# Altium schematic sheet 6_Airframe-NXP_i.MX7.SchDoc
size A2; SheetNumber: 6; SheetTotal: 9
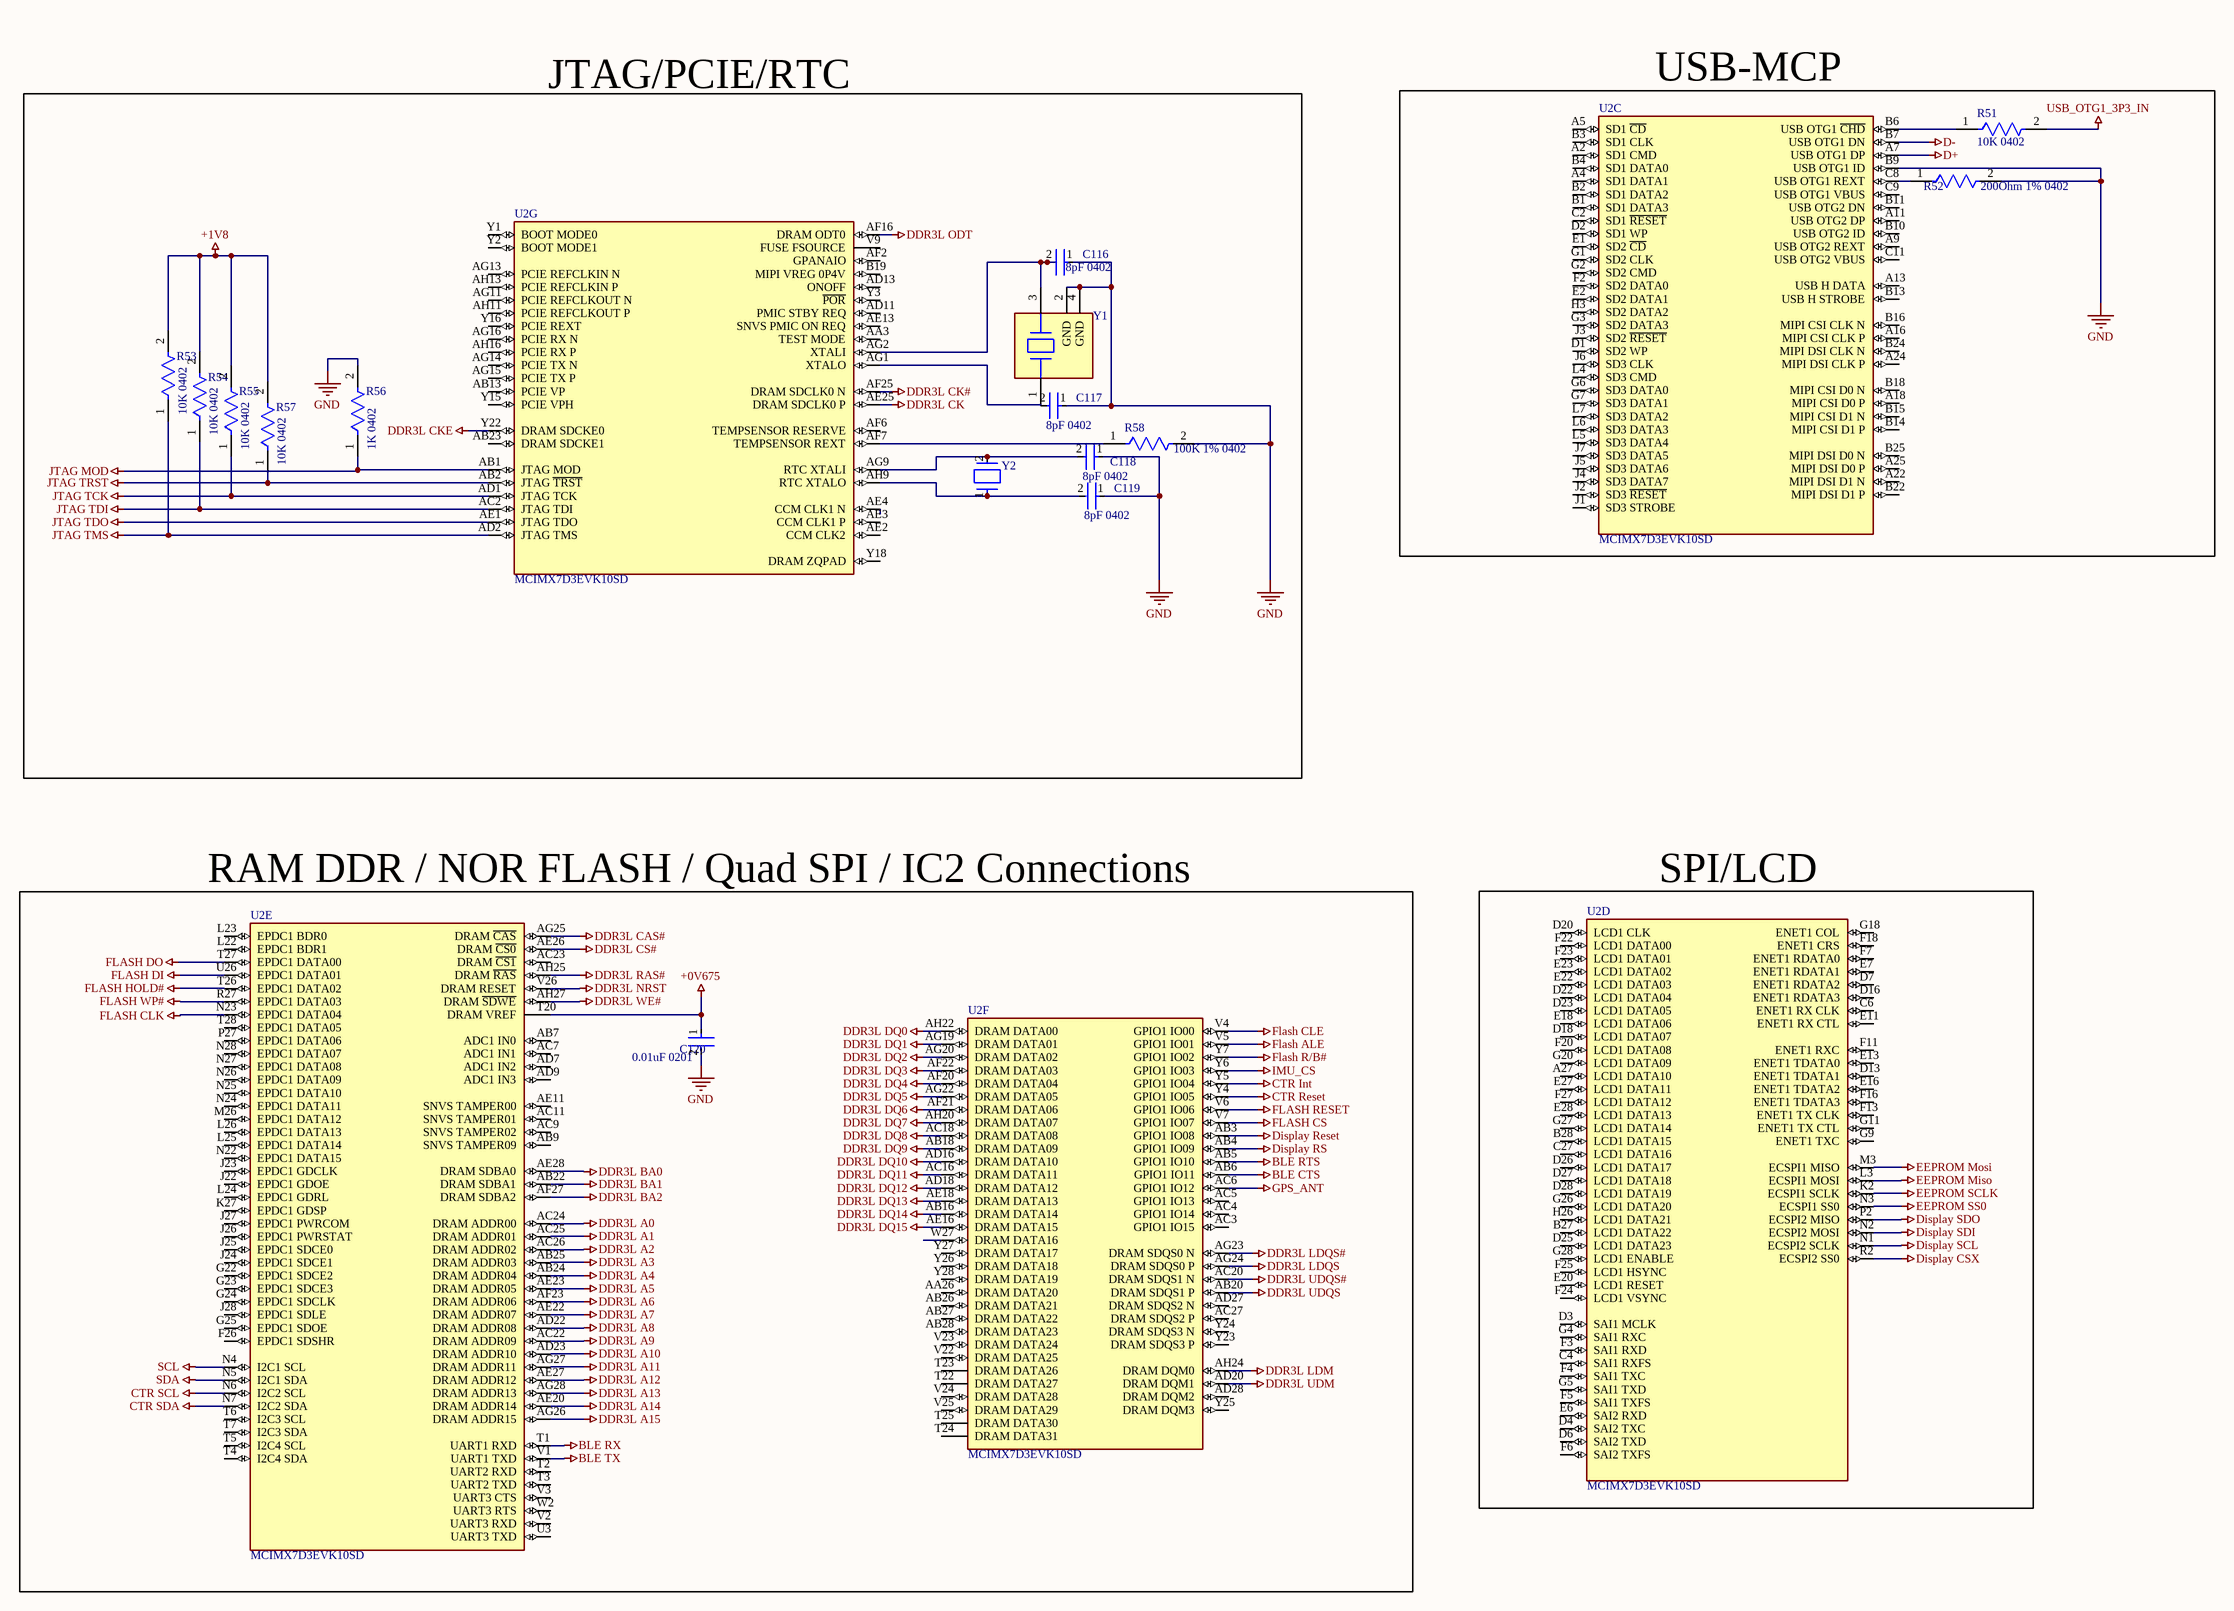
[diagram p0: 6_Airframe-NXP_i.MX7.SchDoc]

## Parts
C116  8pF 0402  [FP-C0402C225M9PACTU-MFG]
C117  8pF 0402  [FP-C0402C225M9PACTU-MFG]
C118  8pF 0402  [FP-C0402C225M9PACTU-MFG]
C119  8pF 0402  [FP-C0402C225M9PACTU-MFG]
C120  0.01uF 0201  [FP-C0603-030-0_03-IPC_C]
R51  10K 0402  [FP-CRCW0402-e3-IPC_B]
R52  200Ohm 1% 0402  [FP-CRCW0402-e3-IPC_C]
R53  10K 0402  [FP-CRCW0402-e3-IPC_B]
R54  10K 0402  [FP-CRCW0402-e3-IPC_B]
R55  10K 0402  [FP-CRCW0402-e3-IPC_B]
R56  1K 0402  [FP-CRCW0402-e3-IPC_B]
R57  10K 0402  [FP-CRCW0402-e3-IPC_B]
R58  100K 1% 0402  [FP-CRCW0402-e3-IPC_C]
U2  MCIMX7D3EVK10SD  [FP-SOT1839-1-IPC_C]  (parts C,D,E,F,G of 9)
Y1  ABM8AIG-24.000MHZ-12-2Z-T3  [FP-ABM8AIG-MFG]  (value not drawn)
Y2  ABS06-32.768KHZ-9-T  [FP-ABS06-MFG]  (value not drawn)

## Nets
+0V675: C120.1 U2.T20(DRAM_VREF)
+1V8: R53.2 R54.2 R55.2 R57.2
BLE CTS: U2.AB6(GPIO1_IO11)
BLE RTS: U2.AB5(GPIO1_IO10)
BLE RX: U2.T1(UART1_RXD)
BLE TX: U2.V1(UART1_TXD)
CTR Int: U2.Y5(GPIO1_IO04)
CTR Reset: U2.Y4(GPIO1_IO05)
CTR SCL: U2.N6(I2C2_SCL)
CTR SDA: U2.N7(I2C2_SDA)
D+: U2.A7(USB_OTG1_DP)
D-: U2.B7(USB_OTG1_DN)
DDR3L A0: U2.AC24(DRAM_ADDR00)
DDR3L A1: U2.AC25(DRAM_ADDR01)
DDR3L A2: U2.AC26(DRAM_ADDR02)
DDR3L A3: U2.AB25(DRAM_ADDR03)
DDR3L A4: U2.AB24(DRAM_ADDR04)
DDR3L A5: U2.AE23(DRAM_ADDR05)
DDR3L A6: U2.AF23(DRAM_ADDR06)
DDR3L A7: U2.AE22(DRAM_ADDR07)
DDR3L A8: U2.AD22(DRAM_ADDR08)
DDR3L A9: U2.AC22(DRAM_ADDR09)
DDR3L A10: U2.AD23(DRAM_ADDR10)
DDR3L A11: U2.AG27(DRAM_ADDR11)
DDR3L A12: U2.AE27(DRAM_ADDR12)
DDR3L A13: U2.AG28(DRAM_ADDR13)
DDR3L A14: U2.AE20(DRAM_ADDR14)
DDR3L A15: U2.AG26(DRAM_ADDR15)
DDR3L BA0: U2.AE28(DRAM_SDBA0)
DDR3L BA1: U2.AB22(DRAM_SDBA1)
DDR3L BA2: U2.AF27(DRAM_SDBA2)
DDR3L CAS#: U2.AG25(DRAM_~{CAS})
DDR3L CK: U2.AE25(DRAM_SDCLK0_P)
DDR3L CK#: U2.AF25(DRAM_SDCLK0_N)
DDR3L CKE: U2.Y22(DRAM_SDCKE0)
DDR3L CS#: U2.AE26(DRAM_~{CS0})
DDR3L DQ0: U2.AH22(DRAM_DATA00)
DDR3L DQ1: U2.AG19(DRAM_DATA01)
DDR3L DQ2: U2.AG20(DRAM_DATA02)
DDR3L DQ3: U2.AF22(DRAM_DATA03)
DDR3L DQ4: U2.AF20(DRAM_DATA04)
DDR3L DQ5: U2.AG22(DRAM_DATA05)
DDR3L DQ6: U2.AF21(DRAM_DATA06)
DDR3L DQ7: U2.AH20(DRAM_DATA07)
DDR3L DQ8: U2.AC18(DRAM_DATA08)
DDR3L DQ9: U2.AB18(DRAM_DATA09)
DDR3L DQ10: U2.AD16(DRAM_DATA10)
DDR3L DQ11: U2.AC16(DRAM_DATA11)
DDR3L DQ12: U2.AD18(DRAM_DATA12)
DDR3L DQ13: U2.AE18(DRAM_DATA13)
DDR3L DQ14: U2.AB16(DRAM_DATA14)
DDR3L DQ15: U2.AE16(DRAM_DATA15)
DDR3L LDM: U2.AH24(DRAM_DQM0)
DDR3L LDQS: U2.AG24(DRAM_SDQS0_P)
DDR3L LDQS#: U2.AG23(DRAM_SDQS0_N)
DDR3L NRST: U2.V26(DRAM_RESET)
DDR3L ODT: U2.AF16(DRAM_ODT0)
DDR3L RAS#: U2.AH25(DRAM_~{RAS})
DDR3L UDM: U2.AD20(DRAM_DQM1)
DDR3L UDQS: U2.AB20(DRAM_SDQS1_P)
DDR3L UDQS#: U2.AC20(DRAM_SDQS1_N)
DDR3L WE#: U2.AH27(DRAM_~{SDWE})
Display CSX: U2.R2(ECSPI2_SS0)
Display Reset: U2.AB3(GPIO1_IO08)
Display RS: U2.AB4(GPIO1_IO09)
Display SCL: U2.N1(ECSPI2_SCLK)
Display SDI: U2.N2(ECSPI2_MOSI)
Display SDO: U2.P2(ECSPI2_MISO)
EEPROM Miso: U2.L3(ECSPI1_MOSI)
EEPROM Mosi: U2.M3(ECSPI1_MISO)
EEPROM SCLK: U2.K2(ECSPI1_SCLK)
EEPROM SS0: U2.N3(ECSPI1_SS0)
Flash ALE: U2.V5(GPIO1_IO01)
Flash CLE: U2.V4(GPIO1_IO00)
FLASH CLK: U2.N23(EPDC1_DATA04)
FLASH CS: U2.V7(GPIO1_IO07)
FLASH DI: U2.U26(EPDC1_DATA01)
FLASH DO: U2.T27(EPDC1_DATA00)
FLASH HOLD#: U2.T26(EPDC1_DATA02)
Flash R/B#: U2.Y7(GPIO1_IO02)
FLASH RESET: U2.V6(GPIO1_IO06)
FLASH WP#: U2.R27(EPDC1_DATA03)
GND: C116.1 C117.1 C118.1 C119.1 C120.2 R52.2 R56.2 R58.2 U2.B9(USB_OTG1_ID) Y1.2(GND) Y1.4(GND)
GPS_ANT: U2.AC6(GPIO1_IO12)
IMU_CS: U2.Y6(GPIO1_IO03)
JTAG MOD: R56.1 U2.AB1(JTAG_MOD)
JTAG TCK: R55.1 U2.AD1(JTAG_TCK)
JTAG TDI: R54.1 U2.AC2(JTAG_TDI)
JTAG TDO: U2.AE1(JTAG_TDO)
JTAG TMS: R53.1 U2.AD2(JTAG_TMS)
JTAG TRST: R57.1 U2.AB2(JTAG_~{TRST})
SCL: U2.N4(I2C1_SCL)
SDA: U2.N5(I2C1_SDA)
USB_OTG1_3P3_IN: R51.2
NetC116_2: C116.2 U2.AG2(XTALI) Y1.3
NetC118_2: C118.2 U2.AG9(RTC_XTALI) Y2.2
NetC119_2: C119.2 U2.AH9(RTC_XTALO) Y2.1
NetR51_1: R51.1 U2.B6(USB_OTG1_~{CHD})
NetR52_1: R52.1 U2.C8(USB_OTG1_REXT)
NetR58_1: R58.1 U2.AF7(TEMPSENSOR_REXT)
NetU2_AG1: U2.AG1(XTALO) Y1.1

Not connected (* = marked no-connect by the designer): C117 2; U2 A2(SD1_CMD) A4(SD1_DATA1) A5(SD1_~{CD}) A9(USB_OTG2_REXT) A11(USB_OTG2_DP) A13(USB_H_DATA) A16(MIPI_CSI_CLK_P) A18(MIPI_CSI_D0_P) A22(MIPI_DSI_D1_N) A24(MIPI_DSI_CLK_P) A25(MIPI_DSI_D0_P) A27(LCD1_DATA10) AA3(TEST_MODE) AA26(DRAM_DATA20) AB7(ADC1_IN0) AB9(SNVS_TAMPER09) AB13(PCIE_VP) AB23(DRAM_SDCKE1) AB26(DRAM_DATA21) AB27(DRAM_DATA22) AB28(DRAM_DATA23) AC3(GPIO1_IO15) AC4(GPIO1_IO14) AC5(GPIO1_IO13) AC7(ADC1_IN1) AC9(SNVS_TAMPER02) AC11(SNVS_TAMPER01) AC23(DRAM_~{CS1}) AC27(DRAM_SDQS2_P) AD7(ADC1_IN2) AD9(ADC1_IN3) AD11(PMIC_STBY_REQ) AD13(ONOFF) AD27(DRAM_SDQS2_N) AD28(DRAM_DQM2) AE2(CCM_CLK2) AE3(CCM_CLK1_P) AE4(CCM_CLK1_N) AE11(SNVS_TAMPER00) AE13(SNVS_PMIC_ON_REQ) AF2(GPANAIO) AF6(TEMPSENSOR_RESERVE) AG11(PCIE_REFCLKOUT_N) AG13(PCIE_REFCLKIN_N) AG14(PCIE_TX_N) AG15(PCIE_TX_P) AG16(PCIE_RX_N) AH11(PCIE_REFCLKOUT_P) AH13(PCIE_REFCLKIN_P) AH16(PCIE_RX_P) B1(SD1_DATA3) B2(SD1_DATA2) B3(SD1_CLK) B4(SD1_DATA0) B10(USB_OTG2_ID) B11(USB_OTG2_DN) B13(USB_H_STROBE) B14(MIPI_CSI_D1_P) B15(MIPI_CSI_D1_N) B16(MIPI_CSI_CLK_N) B18(MIPI_CSI_D0_N) B19(MIPI_VREG_0P4V) B22(MIPI_DSI_D1_P) B24(MIPI_DSI_CLK_N) B25(MIPI_DSI_D0_N) B27(LCD1_DATA22) B28(LCD1_DATA15) C2(SD1_~{RESET}) C4(SAI1_RXFS) C6(ENET1_RX_CLK) C9(USB_OTG1_VBUS) C11(USB_OTG2_VBUS) C27(LCD1_DATA16) D1(SD2_WP) D2(SD1_WP) D3(SAI1_MCLK) D4(SAI2_TXC) D6(SAI2_TXD) D7(ENET1_RDATA2) D13(ENET1_TDATA1) D16(ENET1_RDATA3) D18(LCD1_DATA07) D20(LCD1_CLK) D22(LCD1_DATA04) D23(LCD1_DATA05) D25(LCD1_DATA23) D26(LCD1_DATA17) D27(LCD1_DATA18) D28(LCD1_DATA19) E1(SD2_~{CD}) E2(SD2_DATA1) E6(SAI2_RXD) E7(ENET1_RDATA1) E11(ENET1_RX_CTL) E13(ENET1_TDATA0) E16(ENET1_TDATA2) E18(LCD1_DATA06) E20(LCD1_RESET) E22(LCD1_DATA03) E23(LCD1_DATA02) E27(LCD1_DATA11) E28(LCD1_DATA13) F2(SD2_DATA0) F3(SAI1_RXD) F4(SAI1_TXC) F5(SAI1_TXFS) F6(SAI2_TXFS) F7(ENET1_RDATA0) F11(ENET1_RXC) F13(ENET1_TX_CLK) F16(ENET1_TDATA3) F18(ENET1_CRS) F20(LCD1_DATA08) F22(LCD1_DATA00) F23(LCD1_DATA01) F24(LCD1_VSYNC) F25(LCD1_HSYNC) F26(EPDC1_SDSHR) F27(LCD1_DATA12) G1(SD2_CLK) G2(SD2_CMD) G3(SD2_DATA3) G4(SAI1_RXC) G5(SAI1_TXD) G6(SD3_DATA0) G7(SD3_DATA1) G9(ENET1_TXC) G11(ENET1_TX_CTL) G18(ENET1_COL) G20(LCD1_DATA09) G22(EPDC1_SDCE2) G23(EPDC1_SDCE3) G24(EPDC1_SDCLK) G25(EPDC1_SDOE) G26(LCD1_DATA20) G27(LCD1_DATA14) G28(LCD1_ENABLE) H3(SD2_DATA2) H26(LCD1_DATA21) J1(SD3_STROBE) J2(SD3_~{RESET}) J3(SD2_~{RESET}) J4(SD3_DATA7) J5(SD3_DATA6) J6(SD3_CLK) J7(SD3_DATA5) J22(EPDC1_GDOE) J23(EPDC1_GDCLK) J24(EPDC1_SDCE1) J25(EPDC1_SDCE0) J26(EPDC1_PWRSTAT) J27(EPDC1_PWRCOM) J28(EPDC1_SDLE) K27(EPDC1_GDSP) L4(SD3_CMD) L5(SD3_DATA4) L6(SD3_DATA3) L7(SD3_DATA2) L22(EPDC1_BDR1) L23(EPDC1_BDR0) L24(EPDC1_GDRL) L25(EPDC1_DATA14) L26(EPDC1_DATA13) M26(EPDC1_DATA12) N22(EPDC1_DATA15) N24(EPDC1_DATA11) N25(EPDC1_DATA10) N26(EPDC1_DATA09) N27(EPDC1_DATA08) N28(EPDC1_DATA07) P27(EPDC1_DATA06) T2(UART2_RXD) T3(UART2_TXD) T4(I2C4_SDA) T5(I2C4_SCL) T6(I2C3_SCL) T7(I2C3_SDA) T22(DRAM_DATA27) T23(DRAM_DATA26) T24(DRAM_DATA31) T25(DRAM_DATA30) T28(EPDC1_DATA05) U3(UART3_TXD) V2(UART3_RXD) V3(UART3_CTS) V9(FUSE_FSOURCE) V22(DRAM_DATA25) V23(DRAM_DATA24) V24(DRAM_DATA28) V25(DRAM_DATA29) W2(UART3_RTS) W27(DRAM_DATA16) Y1(BOOT_MODE0) Y2(BOOT_MODE1) Y3(~{POR}) Y15(PCIE_VPH) Y16(PCIE_REXT) Y18(DRAM_ZQPAD) Y23(DRAM_SDQS3_P) Y24(DRAM_SDQS3_N) Y25(DRAM_DQM3) Y26(DRAM_DATA18) Y27(DRAM_DATA17) Y28(DRAM_DATA19)

## Notes on the sheet
- JTAG/PCIE/RTC
- (near U2) USB-MCP
- (near U2) RAM DDR / NOR FLASH / Quad SPI / IC2 Connections
- (near U2) SPI/LCD

## Library data of the parts
C116-C119 = CMP-2008-02064-3: CAP CER 2.2UF 6.3V X5R 0402; Tolerance: 20%; Dissipation Factor: 5%; Dielectric Material: Ceramic; Lead Free: Lead Free; Depth: 0.5mm; Series: C; Termination: SMD/SMT; Case Code (Metric): 1005; Case/Package: 0402; Dielectric: X5R; RoHS Compliant: Yes; Thickness: 0.022inch; Voltage Rating: 6.3V; Voltage: 6.3V; Height: 0.5mm; Mount: Surface Mount; Construction: Flat; Case Code (Imperial): 0402; Min Operating Temperature: -55°C; Contact Plating: Tin; Radiation Hardening: No; Number of Pins: 2; Voltage Rating (DC): 6.3V; Capacitance: 2.2uF; Width: 0.5mm; Package Quantity: 1; Packaging: Tape and Reel; Max Operating Temperature: 85°C; Length: 1mm; REACH SVHC: No SVHC
C120 = CMP-08246-007095-1: Multilayer Ceramic Capacitors 220nF ±10% 6.3V X6S SMD 0201; Dielectric: X6S; Resistor Type: Ceramic; Length: 0.6mm; Capacitance: 220nF; Case Code (Metric): 0603; Series: C; Width: 0.012inch; Height: 0.3mm; Voltage Rating: 6.3V; Max Operating Temperature: 105°C; REACH SVHC: No SVHC; RoHS Compliant: Yes; Tolerance: 10%; Termination: SMD/SMT; Case/Package: 0201; Case Code (Imperial): 0201; Weight: 6E-06oz; Lead Free: Lead Free; Construction: Flat; Thickness: 300um; Mount: Surface Mount; Dielectric Material: Ceramic; Voltage Rating (DC): 6.3V; Packaging: Cut Tape; Package Quantity: 1; Min Operating Temperature: -55°C; Depth: 0.3mm
R51 R53-R57 = CMP-2002-08135-2: RES SMD 10K OHM 1% 1/16W 0402; Power Rating: 63mW; Resistance: 10kR; Voltage Rating: 50V; Temperature Coefficient: 100ppm/°C; Case Code (Metric): 1005; Features: Automotive AEC-Q200; Termination: SMD/SMT; Mount: Surface Mount; Package Quantity: 10; Packaging: Tape and Reel; Case Code (Imperial): 0402; Weight: 2.3E-05oz; Lead Free: Lead Free; Width: 0.02inch; Max Power Dissipation: 63mW; Tolerance: 1%; Number of Terminations: 2; Height: 0.35mm; Number of Pins: 2; Composition: Thick Film; Length: 1mm; Voltage Rating (DC): 50V; Case/Package: 0402; Radiation Hardening: No; Contact Plating: Tin; Depth: 0.5mm; Military Standard: Not; Min Operating Temperature: -55°C; Max Operating Temperature: 155°C
R52 R58 = CMP-1011-00429-3: RES Thick Film, 200Ω, 1%, 0.063W, 100ppm/°C, 0402; Max Power Dissipation: 63mW; Voltage Rating: 50V; Resistance: 200R; Termination: SMD/SMT; Weight: 2.3E-05oz; Case/Package: 0402; Contact Plating: Tin; Number of Pins: 2; Width: 0.5mm; Height: 0.35mm; Case Code (Metric): 1005; Military Standard: Not; Features: Automotive AEC-Q200; Power Rating: 63mW; Temperature Coefficient: 100ppm/°C; Tolerance: 1%; Lead Free: Lead Free; Depth: 0.5mm; Max Operating Temperature: 155°C; Min Operating Temperature: -55°C; Package Quantity: 10; Voltage Rating (DC): 50V; Composition: Thick Film; Mount: Surface Mount; Radiation Hardening: No; Length: 1mm; Packaging: Tape and Reel; Number of Terminations: 2; Case Code (Imperial): 0402
U2 = CMP-10096-000008-1: I.MX 7DUAL: REV 1.3; Manufacturer: NXP; Number Of I2C Channels: 4; Number Of Timers/Counters: 11; Nominal Supply Current: 1-1000mA; Max Junction Temp: +105°C; Number Of Uart Channels: 7; Number Of Cores: 2; Interface: I2C,SPI,UART,USB,Ethernet,I2S,LVDS,PCIe,Other; Ram Size: 256KBytes; Data Bus Width: 32bits; Number Of Usb Channels: 3; Number Of Adc Channels: 1; Standoff Height: 0.13mm; Frequency: 1GHz; Max Supply Voltage: 3.6V; Core Architecture: Arm Cortex-A7; Number Of Spi Channels: 5; Memory Type: FLASH,NAND,DDR2,DDR3,OTHER; Min Supply Voltage: 0.95V; ComponentLink2URL: https://www.nxp.com/docs/en/data-sheet/IMX7DCEC.pdf; Number Of Pwm Channels: 4; Package: SOT1839-1; Temperature: -20°C to +105°C; Footprint Url: https://www.nxp.com/docs/en/package-information/98ASA00727D.pdf; RoHS: TRUE; Temperature Range Low: -20°C; Lead Free: Yes; Category: IC; Ipc Land Pattern Name: BGA784N40P28X28_1200X1200X110; Device Class L3: Microprocessors; Mouser Description: i.MX 7Dual: 2x Cortex A7, 2x USB 2.0 OTG with PHY, PCIe, 2xSDIO/MMC, 2x Ethernet, Security; ComponentLink2Description: Datasheet; Manufacturer Part Number: MCIMX7D3EVK10SD; Octopart: https://octopart.com/mcimx7d3evk10sd-nxp+semiconductors-84356608; Digikey Description: I.MX 7DUAL: REV 1.3; Device Class L1: Integrated Circuits (ICs); Temperature Range High: +105°C; Height: 1.1mm; Automotive: No; Number Of Ethernet Channels: 2; Number Of A/D Converters: 1; Device Class L2: Embedded Processors and Controllers
Y1 = CMP-27762-015716-1: Crystal 24MHz ±20ppm (Tol) ±50ppm (Stability) 12pF FUND 50Ω Automotive 4-Pin Ultra Mini-CSMD T/R; ESR (Equivalent Series Resistance): 50R; Series: ABM8AIG; RoHS Compliant: Yes; Load Capacitance: 12pF; Height: 0.031inch; Min Operating Temperature: -40°C; Mount: Surface Mount; Packaging: Cut Tape; Ratings: AEC-Q200; Case/Package: SMD/SMT; Frequency Stability: 50ppm; Max Operating Temperature: 125°C; Length: 0.126inch; Frequency: 24MHz; Frequency Tolerance: 20ppm; Width: 0.098inch
Y2 = CMP-27762-015421-1: Crystal 32.768kHz ±20ppm (Tol) 9pF FUND 90kΩ 2-Pin Mini-CSMD T/R; ESR (Equivalent Series Resistance): 90kR; Max Operating Temperature: 85°C; Frequency Tolerance: 20ppm; Case/Package: CSMD; Termination: SMD/SMT; RoHS Compliant: Yes; Height: 0.6mm; Load Capacitance: 9pF; Packaging: Tape and Reel; Depth: 1.2mm; Tolerance: 20ppm; Frequency: 32.768kHz; Series: ABS06; Width: 1.2mm; Length: 2mm; Number of Pins: 2; Min Operating Temperature: -40°C; Mount: Surface Mount; Lead Free: Lead Free; Package Quantity: 3000